# Altium schematic sheet 04)SDRAM.SchDoc
size 297 x 209 mm
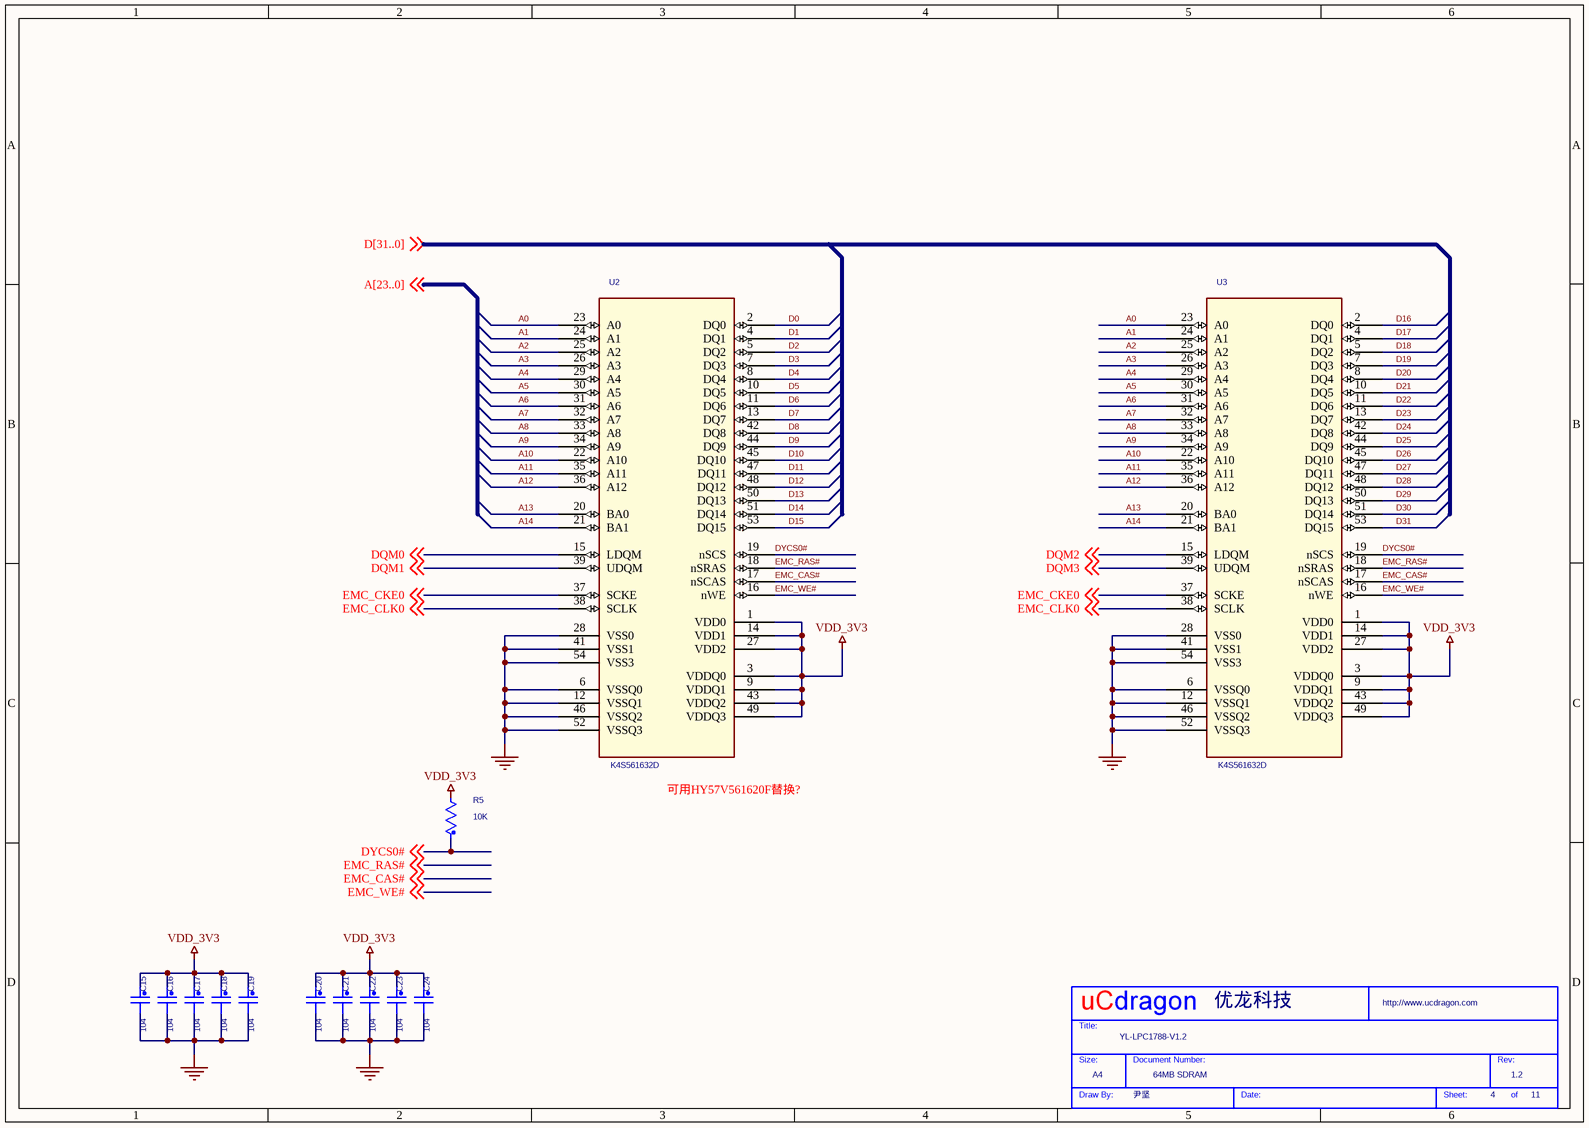
[diagram p0: 04)SDRAM.SchDoc]

## Parts
*  Page Count: 11  Page Number: 4  Page Size: A4  Title: YL-LPC1788-V1.2  RevCode: 1.2  Doc: 64MB SDRAM  Drawing: 尹坚  Company: 优龙科技  (hidden comment: My Title 0)  (graphical)
C15  104  [CAP0805]
C16  104  [CAP0805]
C17  104  [CAP0805]
C18  104  [CAP0805]
C19  104  [CAP0805]
C20  104  [CAP0805]
C21  104  [CAP0805]
C22  104  [CAP0805]
C23  104  [CAP0805]
C24  104  [CAP0805]
R5  10K
U2  K4S561632D
U3  K4S561632D

## Nets
GND_POWER: C15.2 C16.2 C17.2 C18.2 C19.2 C20.2 C21.2 C22.2 C23.2 C24.2 U2.6(VSSQ0) U2.12(VSSQ1) U2.28(VSS0) U2.41(VSS1) U2.46(VSSQ2) U2.52(VSSQ3) U2.54(VSS3) U3.6(VSSQ0) U3.12(VSSQ1) U3.28(VSS0) U3.41(VSS1) U3.46(VSSQ2) U3.52(VSSQ3) U3.54(VSS3)
VDD_3V3: C15.1 C16.1 C17.1 C18.1 C19.1 C20.1 C21.1 C22.1 C23.1 C24.1 R5.2 U2.1(VDD0) U2.3(VDDQ0) U2.9(VDDQ1) U2.14(VDD1) U2.27(VDD2) U2.43(VDDQ2) U2.49(VDDQ3) U3.1(VDD0) U3.3(VDDQ0) U3.9(VDDQ1) U3.14(VDD1) U3.27(VDD2) U3.43(VDDQ2) U3.49(VDDQ3)
A0: U2.23(A0) U3.23(A0)
A1: U2.24(A1) U3.24(A1)
A2: U2.25(A2) U3.25(A2)
A3: U2.26(A3) U3.26(A3)
A4: U2.29(A4) U3.29(A4)
A5: U2.30(A5) U3.30(A5)
A6: U2.31(A6) U3.31(A6)
A7: U2.32(A7) U3.32(A7)
A8: U2.33(A8) U3.33(A8)
A9: U2.34(A9) U3.34(A9)
A10: U2.22(A10) U3.22(A10)
A11: U2.35(A11) U3.35(A11)
A12: U2.36(A12) U3.36(A12)
A13: U2.20(BA0) U3.20(BA0)
A14: U2.21(BA1) U3.21(BA1)
D0: U2.2(DQ0)
D1: U2.4(DQ1)
D2: U2.5(DQ2)
D3: U2.7(DQ3)
D4: U2.8(DQ4)
D5: U2.10(DQ5)
D6: U2.11(DQ6)
D7: U2.13(DQ7)
D8: U2.42(DQ8)
D9: U2.44(DQ9)
D10: U2.45(DQ10)
D11: U2.47(DQ11)
D12: U2.48(DQ12)
D13: U2.50(DQ13)
D14: U2.51(DQ14)
D15: U2.53(DQ15)
D16: U3.2(DQ0)
D17: U3.4(DQ1)
D18: U3.5(DQ2)
D19: U3.7(DQ3)
D20: U3.8(DQ4)
D21: U3.10(DQ5)
D22: U3.11(DQ6)
D23: U3.13(DQ7)
D24: U3.42(DQ8)
D25: U3.44(DQ9)
D26: U3.45(DQ10)
D27: U3.47(DQ11)
D28: U3.48(DQ12)
D29: U3.50(DQ13)
D30: U3.51(DQ14)
D31: U3.53(DQ15)
DQM0: U2.15(LDQM) ; off-sheet DQM0
DQM1: U2.39(UDQM) ; off-sheet DQM1
DQM2: U3.15(LDQM) ; off-sheet DQM2
DQM3: U3.39(UDQM) ; off-sheet DQM3
DYCS0#: R5.1 U2.19(nSCS) U3.19(nSCS) ; off-sheet DYCS0#
EMC_CAS#: U2.17(nSCAS) U3.17(nSCAS) ; off-sheet EMC_CAS#
EMC_CKE0: U2.37(SCKE) U3.37(SCKE) ; off-sheet EMC_CKE0
EMC_CLK0: U2.38(SCLK) U3.38(SCLK) ; off-sheet EMC_CLK0
EMC_RAS#: U2.18(nSRAS) U3.18(nSRAS) ; off-sheet EMC_RAS#
EMC_WE#: U2.16(nWE) U3.16(nWE) ; off-sheet EMC_WE#

## Notes on the sheet
- 可用HY57V561620F替换?
- (in symbol My Title 0) Title:; Size:; Document Number:; Rev:; Draw By:; Date:; Sheet:; of

## Library data of the parts
C15-C24 = C_Generic_Dup2
R5 = R_Generic_Dup1
* = My Title 0: Page Create Date: May 29, 2006; WebSite: http://www.ucdragon.com